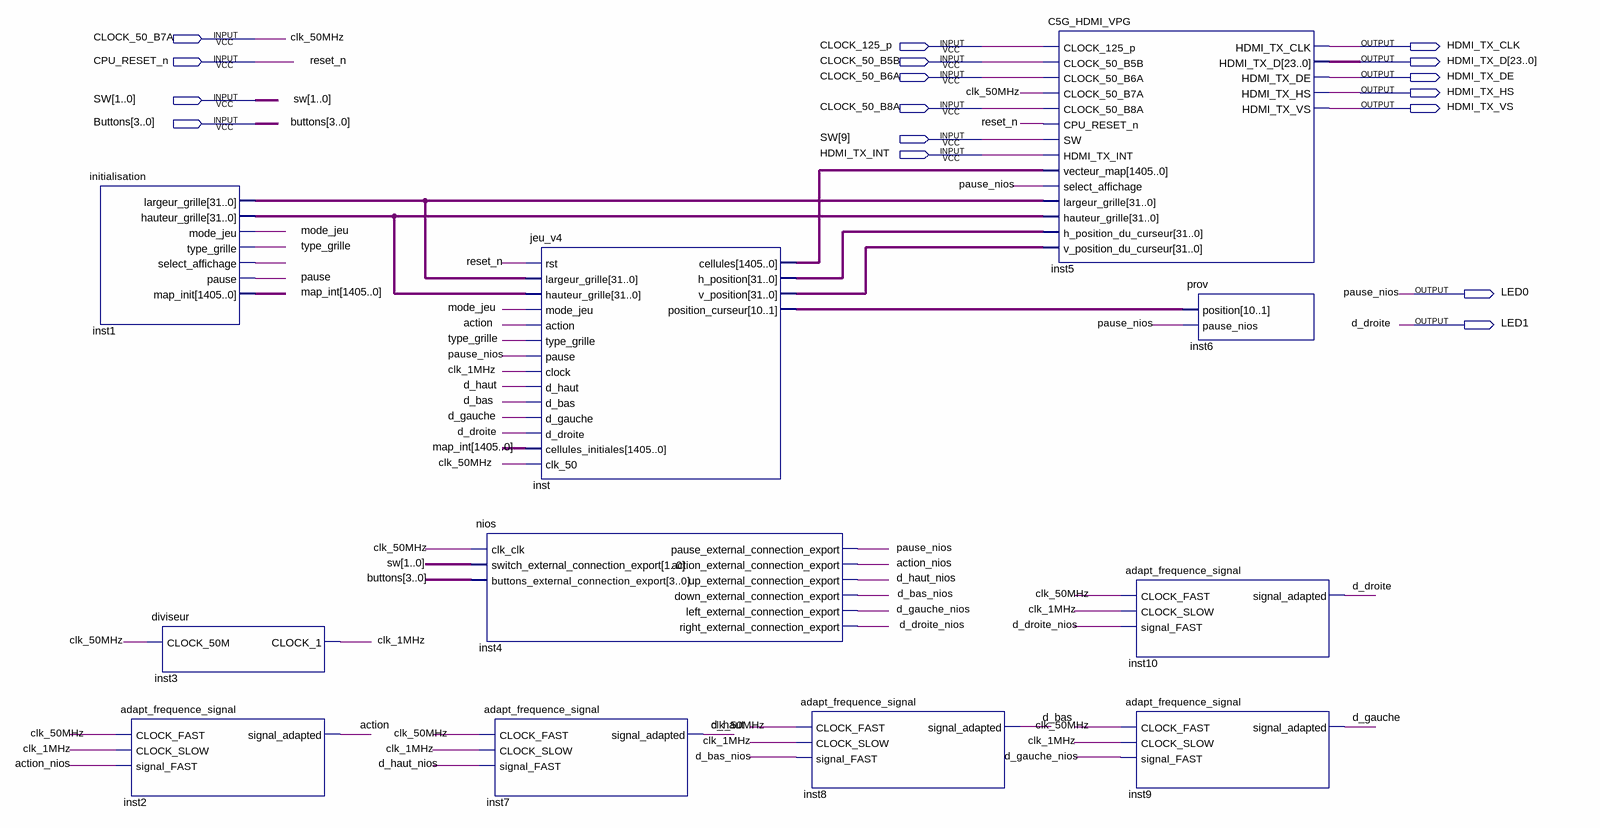
[diagram p0: schematic sheet]
// Quartus schematic tiny_god.bdf as structural Verilog: 11 symbols, 17 pins
module tiny_god (
  input  CLOCK_50_B7A,
  input  CLOCK_125_p,
  input  CPU_RESET_n,
  input  CLOCK_50_B5B,
  input  CLOCK_50_B6A,
  input  [9:0] SW,
  input  CLOCK_50_B8A,
  input  [3:0] Buttons,
  input  HDMI_TX_INT,
  output HDMI_TX_CLK,
  output [23:0] HDMI_TX_D,
  output HDMI_TX_DE,
  output HDMI_TX_HS,
  output HDMI_TX_VS,
  output LED0,
  output LED1
);

  wire action, action_nios, clk_1MHz, d_bas, d_bas_nios, d_droite_nios, d_gauche, d_gauche_nios, d_haut,
       d_haut_nios, inst1_select_affichage, mode_jeu, pause, type_grille;
  wire [9:0] inst_position_curseur;
  wire [31:0] inst1_hauteur_grille, inst1_largeur_grille, inst_h_position, inst_v_position;
  wire [1405:0] inst_cellules, map_int;

  initialisation inst1 (
    .largeur_grille(inst1_largeur_grille), .hauteur_grille(inst1_hauteur_grille), .mode_jeu(mode_jeu),
    .type_grille(type_grille), .select_affichage(inst1_select_affichage), .pause(pause), .map_init(map_int));
  adapt_frequence_signal inst2 (
    .CLOCK_FAST(CLOCK_50_B7A), .CLOCK_SLOW(clk_1MHz), .signal_FAST(action_nios), .signal_adapted(action));
  diviseur inst3 (.CLOCK_50M(CLOCK_50_B7A), .CLOCK_1(clk_1MHz));
  nios inst4 (
    .clk_clk(CLOCK_50_B7A), .switch_external_connection_export(SW[1:0]),
    .buttons_external_connection_export(Buttons), .pause_external_connection_export(LED0),
    .action_external_connection_export(action_nios), .up_external_connection_export(d_haut_nios),
    .down_external_connection_export(d_bas_nios), .left_external_connection_export(d_gauche_nios),
    .right_external_connection_export(d_droite_nios));
  adapt_frequence_signal inst7 (
    .CLOCK_FAST(CLOCK_50_B7A), .CLOCK_SLOW(clk_1MHz), .signal_FAST(d_haut_nios), .signal_adapted(d_haut));
  jeu_v4 inst (
    .rst(CPU_RESET_n), .largeur_grille(inst1_largeur_grille), .hauteur_grille(inst1_hauteur_grille),
    .mode_jeu(mode_jeu), .action(action), .type_grille(type_grille), .pause(LED0), .clock(clk_1MHz),
    .d_haut(d_haut), .d_bas(d_bas), .d_gauche(d_gauche), .d_droite(LED1), .cellules_initiales(map_int),
    .clk_50(CLOCK_50_B7A), .cellules(inst_cellules), .h_position(inst_h_position),
    .v_position(inst_v_position), .position_curseur(inst_position_curseur));
  adapt_frequence_signal inst8 (
    .CLOCK_FAST(CLOCK_50_B7A), .CLOCK_SLOW(clk_1MHz), .signal_FAST(d_bas_nios), .signal_adapted(d_bas));
  C5G_HDMI_VPG inst5 (
    .CLOCK_125_p(CLOCK_125_p), .CLOCK_50_B5B(CLOCK_50_B5B), .CLOCK_50_B6A(CLOCK_50_B6A),
    .CLOCK_50_B7A(CLOCK_50_B7A), .CLOCK_50_B8A(CLOCK_50_B8A), .CPU_RESET_n(CPU_RESET_n), .SW(SW[9]),
    .HDMI_TX_INT(HDMI_TX_INT), .vecteur_map(inst_cellules), .select_affichage(LED0),
    .largeur_grille(inst1_largeur_grille), .hauteur_grille(inst1_hauteur_grille),
    .h_position_du_curseur(inst_h_position), .v_position_du_curseur(inst_v_position),
    .HDMI_TX_CLK(HDMI_TX_CLK), .HDMI_TX_D(HDMI_TX_D), .HDMI_TX_DE(HDMI_TX_DE), .HDMI_TX_HS(HDMI_TX_HS),
    .HDMI_TX_VS(HDMI_TX_VS));
  adapt_frequence_signal inst10 (
    .CLOCK_FAST(CLOCK_50_B7A), .CLOCK_SLOW(clk_1MHz), .signal_FAST(d_droite_nios), .signal_adapted(LED1));
  adapt_frequence_signal inst9 (
    .CLOCK_FAST(CLOCK_50_B7A), .CLOCK_SLOW(clk_1MHz), .signal_FAST(d_gauche_nios), .signal_adapted(d_gauche));
  prov inst6 (.position(inst_position_curseur), .pause_nios(LED0));

  // Other names for the same wires on the sheet: clk_50MHz = CLOCK_50_B7A; d_droite = LED1; pause_nios = LED0;
  //   reset_n = CPU_RESET_n
endmodule
